# Altium schematic sheet LuxLogger_V2_sensors.SchDoc: LuxLogger V2
size A3; Engineer: ChEn; SheetNumber: 2; SheetTotal: 2
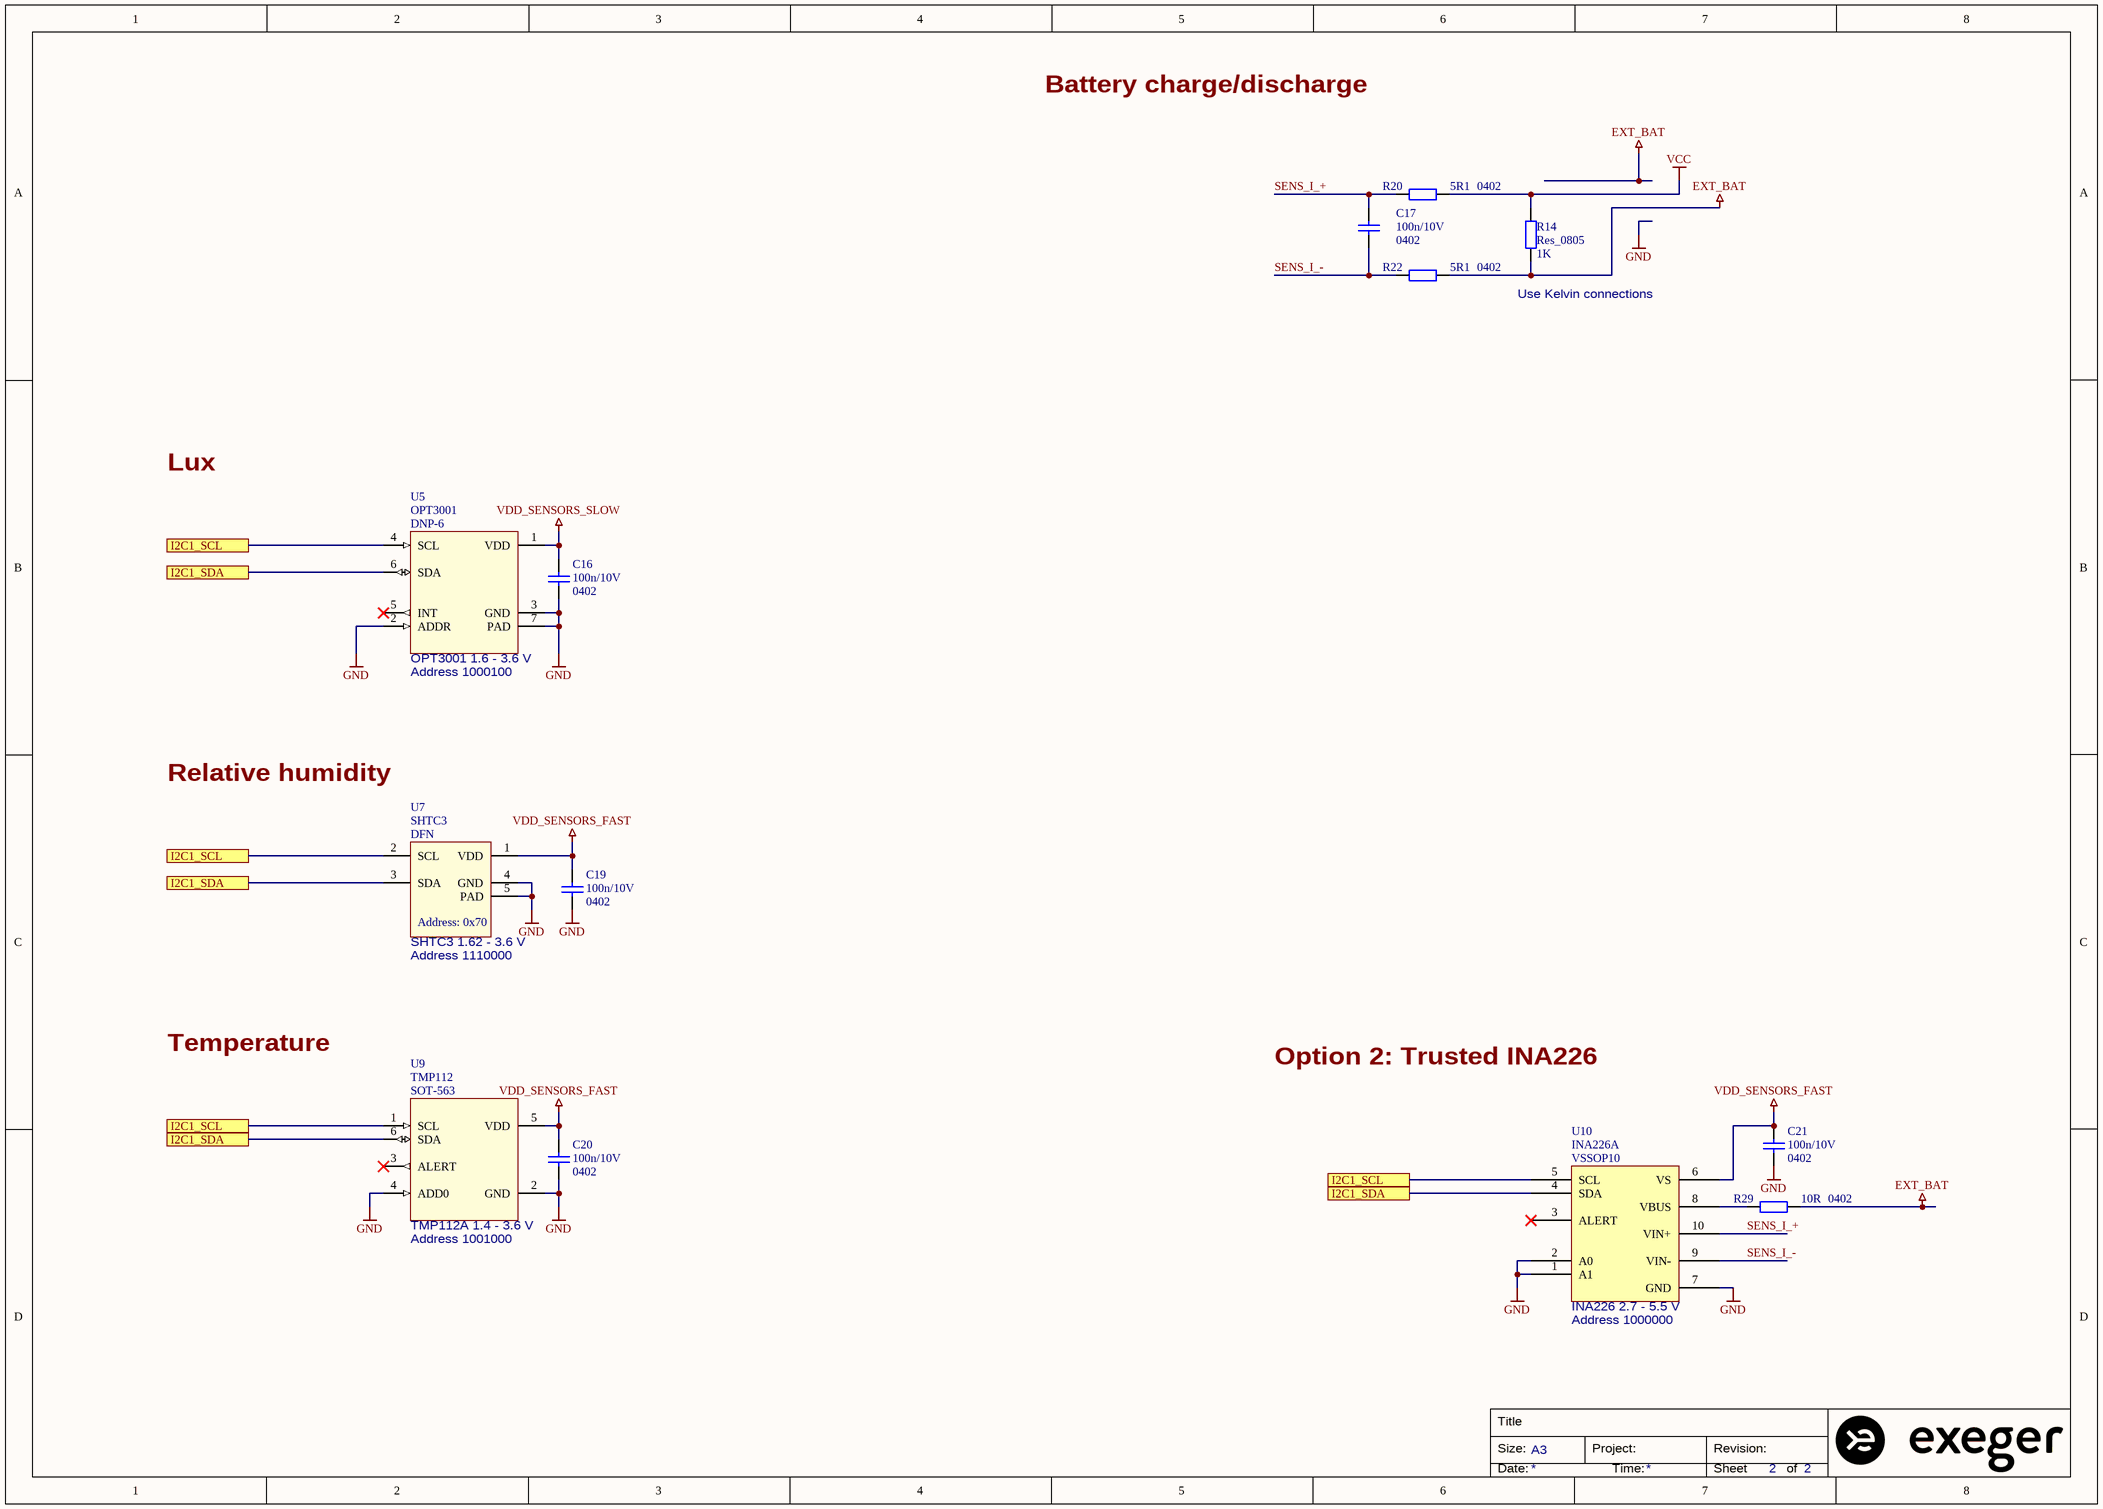
[diagram p0: LuxLogger_V2_sensors.SchDoc]

## Parts
C16  Specification: 100n/10V  Package: 0402  [CAP0402]
C17  Specification: 100n/10V  Package: 0402  [CAP0402]
C19  Specification: 100n/10V  Package: 0402  [CAP0402]
C20  Specification: 100n/10V  Package: 0402  [CAP0402]
C21  Specification: 100n/10V  Package: 0402  [CAP0402]
R14  Res_0805  value 1K  [0805]
R20  Package: 0402  Specification: 5R1  [RES0402]
R22  Package: 0402  Specification: 5R1  [RES0402]
R29  Package: 0402  Specification: 10R  [RES0402]
U5  Package: DNP-6  [OPT3001]
U7  Package: DFN  [SHTC3]
U9  Package: SOT-563  Specification: TMP112  [SOTFL50P160X60-6N]
U10  Package: VSSOP10  Specification: INA226A  [VSSOP-10]

## Ports
I2C1_SCL, I2C1_SDA

## Nets
EXT_BAT: R14.1 R22.1 R29.1
GND: C16.1 C19.1 C20.1 C21.1 U5.2(ADDR) U5.3(GND) U5.7(PAD) U7.4(GND) U7.5(PAD) U9.2(GND) U9.4(ADD0) U10.1(A1) U10.2(A0) U10.7(GND)
VCC: R14.2 R20.1
VDD_SENSORS_FAST: C19.2 C20.2 C21.2 U7.1(VDD) U9.5(VDD) U10.6(VS)
VDD_SENSORS_SLOW: C16.2 U5.1(VDD)
I2C1_SCL: U5.4(SCL) U7.2(SCL) U9.1(SCL) U10.5(SCL) ; port I2C1_SCL
I2C1_SDA: U5.6(SDA) U7.3(SDA) U9.6(SDA) U10.4(SDA) ; port I2C1_SDA
SENS_I_+: C17.2 R20.2 U10.10(VIN+)
SENS_I_-: C17.1 R22.2 U10.9(VIN-)
NetR29_2: R29.2 U10.8(VBUS)

Not connected (* = marked no-connect by the designer): U5 5(INT)*; U9 3(ALERT)*; U10 3(ALERT)*

## Notes on the sheet
- Battery charge/discharge
- (near R14) Use Kelvin connections
- Lux
- (near U5) Address 1000100
- (near U5) OPT3001 1.6 - 3.6 V
- Relative humidity
- (near U7) SHTC3 1.62 - 3.6 V
- Address 1110000
- Temperature
- Option 2: Trusted INA226
- (near U9) TMP112A 1.4 - 3.6 V
- (near U9) Address 1001000
- (near U10) Address 1000000
- (near U10) INA226 2.7 - 5.5 V
- Title
- Size:
- A3
- Project:
- Revision:
- Date:
- Time:
- Sheet
- of
- (in symbol SHTC3) Address: 0x70

## Library data of the parts
C16 C17 C19-C21 = Cap: Capacitor
R14 = Res_0805: Resistor; Published: 8-Jun-2000; LatestRevisionDate: 17-Jul-2002; LatestRevisionNote: Re-released for DXP Platform.; PackageReference: AXIAL-0.4; Publisher: Altium Limited; PackageDescription: Axial Device, Thru-Hole; 2 Leads; 0.4 in Pin Spacing
R20 R22 R29 = Res2: Resistor
U5 = OPT3001: Lux sensor; Manufacturer: TI; Manufacturer PN: OPT3001DNP; Specification: OPT3001
U7 = SHTC3: SHTC3 RH sensor; Manufacturer: SENSIRION; Manufacturer PN: SHTC3; Specification: SHTC3
U9 = TMP112A: Temp_Sensor; Manufacturer: TI; Manufacturer PN: TMP112AIDR
U10 = INA226: Current and power monitor; Manufacturer PN: INA226AIDGS; Manufacturer: TI